# EAGLE board 5409057D (EAGLE 6.6.0), part 1 of 3
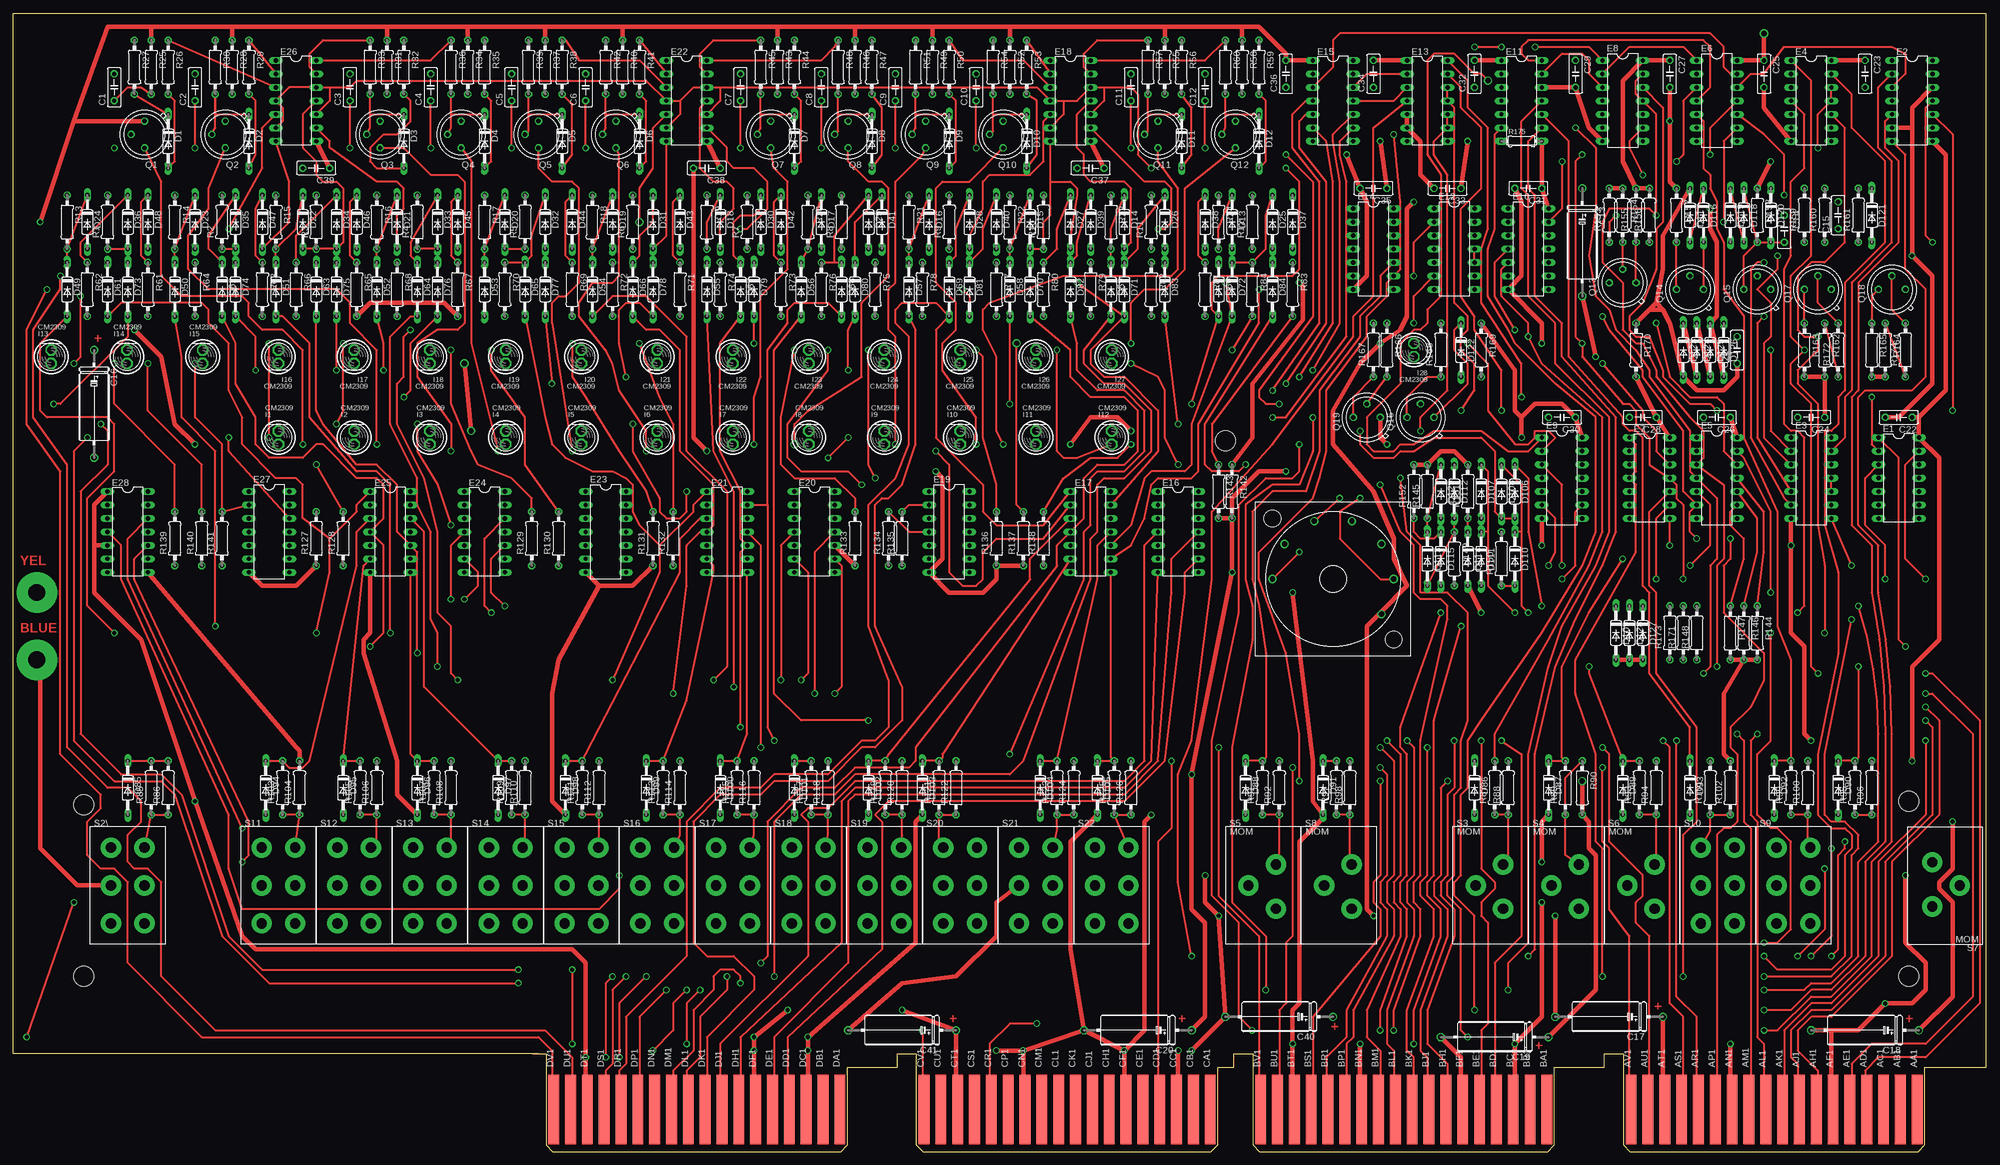
[diagram p3: board, top side]
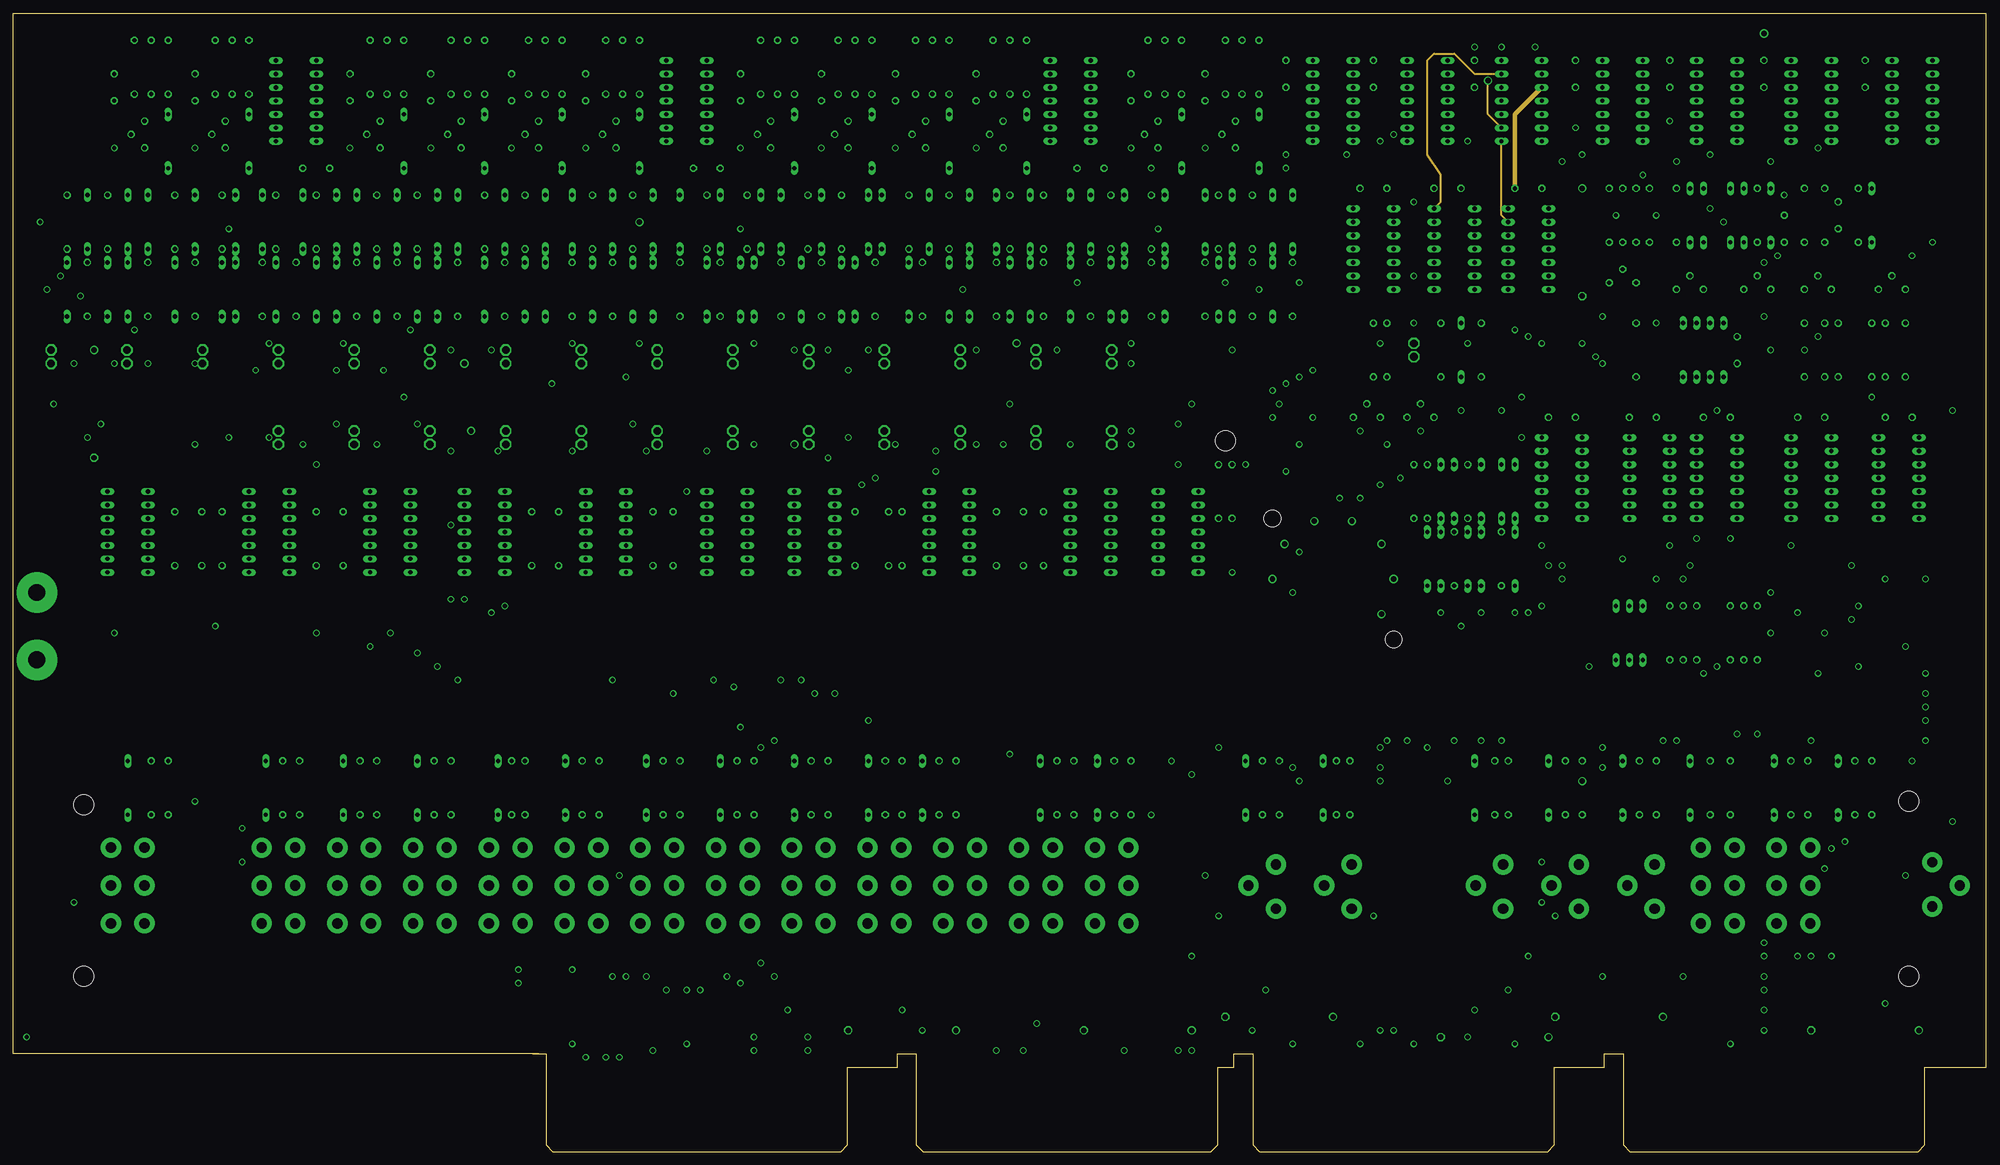
[diagram p4: board, inner layer ECO1]
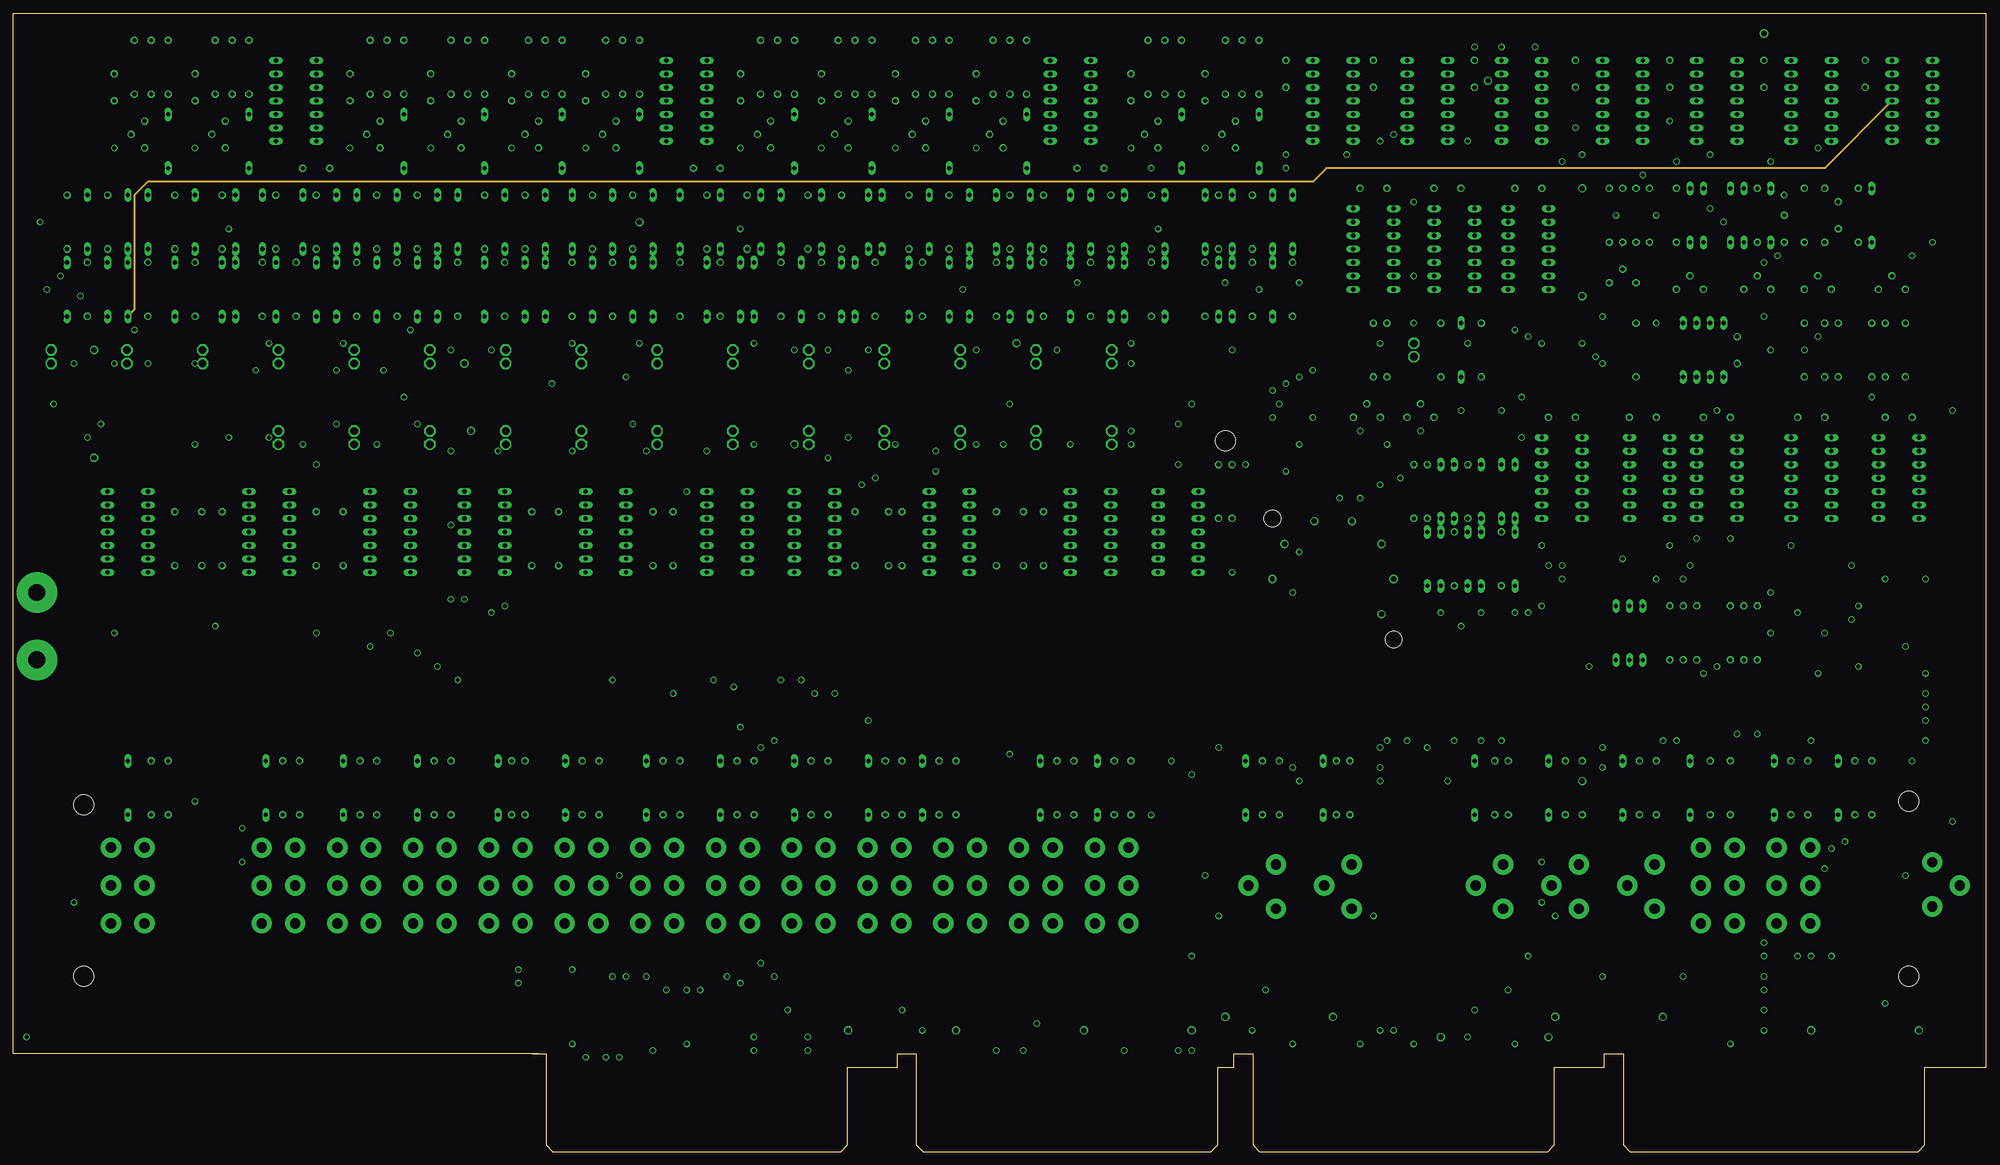
[diagram p5: board, inner layer ECO2]
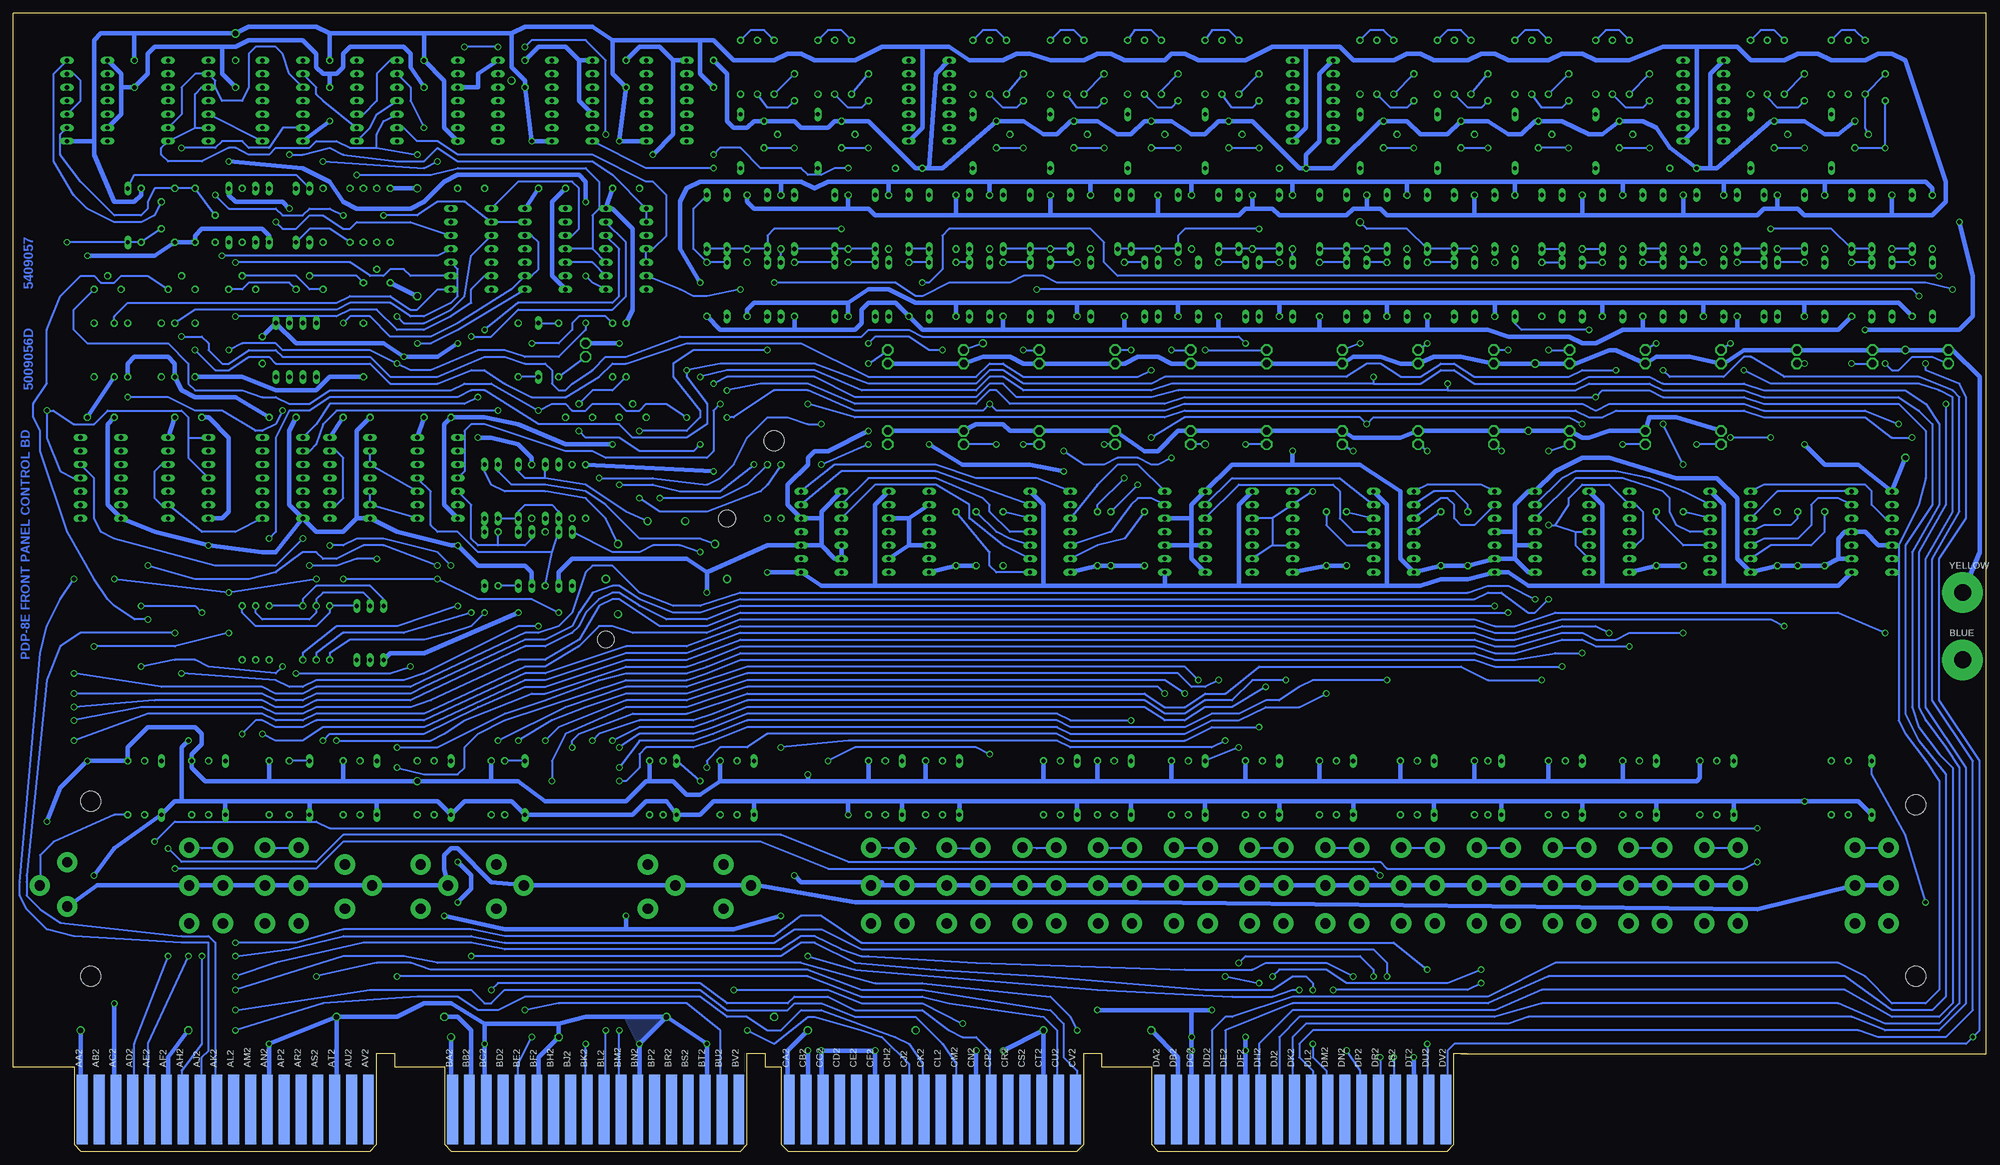
[diagram p6: board, bottom side, seen from below]

Size 372.11 x 214.63 mm. Coordinates in mm from the lower left corner, seen from the top.
Outline: 99.06,18.41 0,18.41 0,214.63 372.11,214.63 372.11,15.88 363.22,15.88
Copper layers (1+2+3+16): Top 0.035mm / dielectric 1.5mm / ECO1 0.035mm / dielectric 0.15mm / ECO2 0.035mm / dielectric 0.2mm / Bottom 0.035mm
Design rules "16mils": minimum track width 16mil, minimum drill 32mil, track to track 15mil, track to pad 10mil, pad to pad 10mil, via to via 10mil, smd to smd 10mil, copper to edge 13mil, drill to drill 10mil, minimum pad ring 10mil, minimum via ring 8mil, stop-mask expansion 0mil, vias tented up to drill 0mil, thermal gap 10mil
Net classes: 1 Supply: width 0.813 mm
Holes 3.81 mm at 13.34,65.41 13.34,33.02 357.5,33.02 357.5,66.04 228.6,133.99

## Footprints (pad centres in the part's own frame; a part is rotated, then mirrored left to right if it is on the bottom)
SPADELUG = drill 3.175 pad 7.62: 1 0,0
C050-025X075 = drill 0.813 octagon: 1 -2.54,0; 2 2.54,0
E12-8 = drill 1.016: + -10.16,0 | drill 1.016 octagon: - 10.16,0
DO35-10 = drill 0.813 long: A 5.08,0; C -5.08,0
DIL14 = drill 0.813 long: 1 -7.62,-3.81; 2 -5.08,-3.81; 3 -2.54,-3.81; 4 0,-3.81; 5 2.54,-3.81; 6 5.08,-3.81; 7 7.62,-3.81; 8 7.62,3.81; 9 5.08,3.81; 10 2.54,3.81; 11 0,3.81; 12 -2.54,3.81; 13 -5.08,3.81; 14 -7.62,3.81
BULB = drill 1.422 octagon: A 0,0; B 0,2.54
TO39 = drill 0.813 octagon: 1 0,-2.54; 2 2.54,0; 3 0,2.54
0207/10 = drill 0.813 octagon: 1 -5.08,0; 2 5.08,0
0204/7 = drill 0.813 octagon: 1 -3.81,0; 2 3.81,0
ROTARY-8E = drill 1.016: 1 -11.43,0; 2 -9.144,6.604; 3 -3.556,10.922; 4 3.556,10.922; 5 9.144,6.604; 6 11.43,0; S 9.144,-6.604 | hole 3.175: -11.43,11.43; 11.43,-11.43
DPDT8I = drill 1.93 pad 3.81: L1 -3.175,7.144; L2 -3.175,0; L3 -3.175,-7.144; R1 3.175,7.144; R2 3.175,0; R3 3.175,-7.144
SPDT8I = drill 1.93 pad 3.81: A1 2.381,3.969; A2 -2.778,0; A3 2.381,-4.366
EDGE-CON8 = smd 2.032 x 13.106: AA1 261.303,7.938; AB1 258.127,7.938; AC1 254.952,7.938; AD1 251.778,7.938; AE1 248.602,7.938; AF1 245.428,7.938; AH1 242.252,7.938; AJ1 239.077,7.938; AK1 235.903,7.938; AL1 232.727,7.938; AM1 229.553,7.938; AN1 226.377,7.938; AP1 223.202,7.938; AR1 220.028,7.938; AS1 216.852,7.938; AT1 213.678,7.938; AU1 210.502,7.938; AV1 207.327,7.938; BA1 191.452,7.938; BB1 188.278,7.938; BC1 185.102,7.938; BD1 181.928,7.938; BE1 178.752,7.938; BF1 175.577,7.938; BH1 172.403,7.938; BJ1 169.227,7.938; BK1 166.053,7.938; BL1 162.877,7.938; BM1 159.702,7.938; BN1 156.528,7.938; BP1 153.352,7.938; BR1 150.178,7.938; BS1 147.002,7.938; BT1 143.827,7.938; BU1 140.653,7.938; BV1 137.477,7.938; CA1 127.953,7.938; CB1 124.778,7.938; CC1 121.603,7.938; CD1 118.427,7.938; CE1 115.252,7.938; CF1 112.078,7.938; CH1 108.903,7.938; CJ1 105.728,7.938; CK1 102.552,7.938; CL1 99.377,7.938; CM1 96.203,7.938; CN1 93.028,7.938; CP1 89.853,7.938; CR1 86.677,7.938; CS1 83.502,7.938; CT1 80.328,7.938; CU1 77.153,7.938; CV1 73.978,7.938; DA1 58.102,7.938; DB1 54.928,7.938; DC1 51.752,7.938; DD1 48.578,7.938; DE1 45.403,7.938; DF1 42.227,7.938; DH1 39.053,7.938; DJ1 35.877,7.938; DK1 32.703,7.938; DL1 29.527,7.938; DM1 26.352,7.938; DN1 23.177,7.938; DP1 20.003,7.938; DR1 16.828,7.938; DS1 13.652,7.938; DT1 10.477,7.938; DU1 7.303,7.938; DV1 4.128,7.938 | smd 2.032 x 13.106 bottom: AA2 261.303,7.938; AB2 258.127,7.938; AC2 254.952,7.938; AD2 251.778,7.938; AE2 248.602,7.938; AF2 245.428,7.938; AH2 242.252,7.938; AJ2 239.077,7.938; AK2 235.903,7.938; AL2 232.727,7.938; AM2 229.553,7.938; AN2 226.377,7.938; AP2 223.202,7.938; AR2 220.028,7.938; AS2 216.852,7.938; AT2 213.678,7.938; AU2 210.502,7.938; AV2 207.327,7.938; BA2 191.452,7.938; BB2 188.278,7.938; BC2 185.102,7.938; BD2 181.928,7.938; BE2 178.752,7.938; BF2 175.577,7.938; BH2 172.403,7.938; BJ2 169.227,7.938; BK2 166.053,7.938; BL2 162.877,7.938; BM2 159.702,7.938; BN2 156.528,7.938; BP2 153.352,7.938; BR2 150.178,7.938; BS2 147.002,7.938; BT2 143.827,7.938; BU2 140.653,7.938; BV2 137.477,7.938; CA2 127.953,7.938; CB2 124.778,7.938; CC2 121.603,7.938; CD2 118.427,7.938; CE2 115.252,7.938; CF2 112.078,7.938; CH2 108.903,7.938; CJ2 105.728,7.938; CK2 102.552,7.938; CL2 99.377,7.938; CM2 96.203,7.938; CN2 93.028,7.938; CP2 89.853,7.938; CR2 86.677,7.938; CS2 83.502,7.938; CT2 80.328,7.938; CU2 77.153,7.938; CV2 73.978,7.938; DA2 58.102,7.938; DB2 54.928,7.938; DC2 51.752,7.938; DD2 48.578,7.938; DE2 45.403,7.938; DF2 42.227,7.938; DH2 39.053,7.938; DJ2 35.877,7.938; DK2 32.703,7.938; DL2 29.527,7.938; DM2 26.352,7.938; DN2 23.177,7.938; DP2 20.003,7.938; DR2 16.828,7.938; DS2 13.652,7.938; DT2 10.477,7.938; DU2 7.303,7.938; DV2 4.128,7.938

## Placement (x,y rotation side)
BLUE  LUG  [SPADELUG]  4.45,92.71 0 bottom
C1  68pF  [C050-025X075]  19.05,200.66 90 top
C2  68pF  [C050-025X075]  34.29,200.66 90 top
C3  68pF  [C050-025X075]  63.5,200.66 90 top
C4  68pF  [C050-025X075]  78.74,200.66 90 top
C5  68pF  [C050-025X075]  93.98,200.66 90 top
C6  68pF  [C050-025X075]  107.95,200.66 90 top
C7  68pF  [C050-025X075]  137.16,200.66 90 top
C8  68pF  [C050-025X075]  152.4,200.66 90 top
C9  68pF  [C050-025X075]  166.37,200.66 90 top
C10  68pF  [C050-025X075]  181.61,200.66 90 top
C11  68pF  [C050-025X075]  210.82,200.66 90 top
C12  68pF  [C050-025X075]  224.79,200.66 90 top
C13  39uF  [E12-8]  295.91,171.45 270 top
C14  56pF  [C050-025X075]  334.01,173.99 270 top
C15  330pF  [C050-025X075]  344.17,176.53 90 top
C16  6.8uF  [E12-8]  15.24,140.97 270 top
C17  6.8uF  [E12-8]  300.99,25.4 180 top
C18  6.8uF  [E12-8]  349.25,22.86 180 top
C19  6.8uF  [E12-8]  279.4,21.59 180 top
C20  6.8uF  [E12-8]  212.09,22.86 180 top
C21  .01uF  [C050-025X075]  325.12,151.13 90 top
C22  .01uF  [C050-025X075]  355.6,138.43 180 top
C23  .01uF  [C050-025X075]  349.25,203.2 270 top
C24  .01uF  [C050-025X075]  339.09,138.43 180 top
C25  .01uF  [C050-025X075]  330.2,203.2 270 top
C26  .01uF  [C050-025X075]  321.31,138.43 180 top
C27  .01uF  [C050-025X075]  312.42,203.2 270 top
C28  .01uF  [C050-025X075]  307.34,138.43 180 top
C29  .01uF  [C050-025X075]  294.64,203.2 270 top
C30  .01uF  [C050-025X075]  292.1,138.43 180 top
C31  .01uF  [C050-025X075]  285.75,181.61 180 top
C32  .01uF  [C050-025X075]  275.59,203.2 90 top
C33  .01uF  [C050-025X075]  270.51,181.61 180 top
C34  .01uF  [C050-025X075]  256.54,203.2 90 top
C35  .01uF  [C050-025X075]  256.54,181.61 180 top
C36  .01uF  [C050-025X075]  240.03,203.2 90 top
C37  .01uF  [C050-025X075]  203.2,185.42 180 top
C38  .01uF  [C050-025X075]  130.81,185.42 180 top
C39  .01uF  [C050-025X075]  57.15,185.42 180 top
C40  6.8uF  [E12-8]  238.76,25.4 180 top
C41  6.8uF  [E12-8]  167.64,22.86 180 top
D1  D664  [DO35-10]  29.21,190.5 270 top
D2  D664  [DO35-10]  44.45,190.5 270 top
D3  D664  [DO35-10]  73.66,190.5 270 top
D4  D664  [DO35-10]  88.9,190.5 270 top
D5  D664  [DO35-10]  103.5,190.5 270 top
D6  D664  [DO35-10]  118.11,190.5 270 top
D7  D664  [DO35-10]  147.32,190.5 270 top
D8  D664  [DO35-10]  161.93,190.5 270 top
D9  D664  [DO35-10]  176.53,190.5 270 top
D10  D664  [DO35-10]  191.13,190.5 270 top
D11  D664  [DO35-10]  220.34,190.5 270 top
D12  D664  [DO35-10]  234.95,190.5 270 top
D13  D664  [DO35-10]  229.87,175.26 270 top
D14  D664  [DO35-10]  209.55,175.26 270 top
D15  D664  [DO35-10]  191.77,175.26 270 top
D16  D664  [DO35-10]  172.72,175.26 270 top
D17  D664  [DO35-10]  152.4,175.26 270 top
D18  D664  [DO35-10]  133.35,175.26 270 top
D19  D664  [DO35-10]  113.03,175.26 270 top
D20  D664  [DO35-10]  92.71,175.26 270 top
D21  D664  [DO35-10]  72.39,175.26 270 top
D22  D664  [DO35-10]  54.61,175.26 270 top
D23  D664  [DO35-10]  34.29,175.26 270 top
D24  D664  [DO35-10]  13.97,175.26 270 top
D25  D664  [DO35-10]  237.49,175.26 270 top
D26  D664  [DO35-10]  217.17,175.26 270 top
D27  D664  [DO35-10]  199.39,175.26 270 top
D28  D664  [DO35-10]  180.34,175.26 270 top
D29  D664  [DO35-10]  161.29,175.26 270 top
D30  D664  [DO35-10]  140.97,175.26 270 top
D31  D664  [DO35-10]  120.65,175.26 270 top
D32  D664  [DO35-10]  100.33,175.26 270 top
D33  D664  [DO35-10]  80.01,175.26 270 top
D34  D664  [DO35-10]  60.96,175.26 270 top
D35  D664  [DO35-10]  41.91,175.26 270 top
D36  D664  [DO35-10]  21.59,175.26 270 top
D37  D664  [DO35-10]  241.3,175.26 270 top
D38  D664  [DO35-10]  224.79,175.26 270 top
D39  D664  [DO35-10]  203.2,175.26 270 top
D40  D664  [DO35-10]  185.42,175.26 270 top
D41  D664  [DO35-10]  163.83,175.26 270 top
D42  D664  [DO35-10]  144.78,175.26 270 top
D43  D664  [DO35-10]  125.73,175.26 270 top
D44  D664  [DO35-10]  105.41,175.26 270 top
D45  D664  [DO35-10]  83.82,175.26 270 top
D46  D664  [DO35-10]  64.77,175.26 270 top
D47  D664  [DO35-10]  46.99,175.26 270 top
D48  D664  [DO35-10]  25.4,175.26 270 top
D49  D664  [DO35-10]  10.16,162.56 270 top
D50  D664  [DO35-10]  30.48,162.56 270 top
D51  D664  [DO35-10]  49.53,162.56 270 top
D52  D664  [DO35-10]  68.58,162.56 270 top
D53  D664  [DO35-10]  88.9,162.56 270 top
D54  D664  [DO35-10]  109.22,162.56 270 top
D55  D664  [DO35-10]  130.81,162.56 270 top
D56  D664  [DO35-10]  148.59,162.56 270 top
D57  D664  [DO35-10]  168.91,162.56 270 top
D58  D664  [DO35-10]  187.96,162.56 270 top
D59  D664  [DO35-10]  207.01,162.56 270 top
D60  D664  [DO35-10]  227.33,162.56 270 top
D61  D664  [DO35-10]  17.78,162.56 270 top
D62  D664  [DO35-10]  39.37,162.56 270 top
D63  D664  [DO35-10]  57.15,162.56 270 top
D64  D664  [DO35-10]  76.2,162.56 270 top
D65  D664  [DO35-10]  96.52,162.56 270 top
D66  D664  [DO35-10]  116.84,162.56 270 top
D67  D664  [DO35-10]  137.16,162.56 270 top
D68  D664  [DO35-10]  156.21,162.56 270 top
D69  D664  [DO35-10]  176.53,162.56 270 top
D70  D664  [DO35-10]  191.77,162.56 270 top
D71  D664  [DO35-10]  209.55,162.56 270 top
D72  D664  [DO35-10]  229.87,162.56 270 top
D73  D664  [DO35-10]  21.59,162.56 270 top
D74  D664  [DO35-10]  41.91,162.56 270 top
D75  D664  [DO35-10]  60.96,162.56 270 top
D76  D664  [DO35-10]  80.01,162.56 270 top
D77  D664  [DO35-10]  100.33,162.56 270 top
D78  D664  [DO35-10]  120.65,162.56 270 top
D79  D664  [DO35-10]  139.7,162.56 270 top
D80  D664  [DO35-10]  158.75,162.56 270 top
D81  D664  [DO35-10]  180.34,162.56 270 top
D82  D664  [DO35-10]  199.39,162.56 270 top
D83  D664  [DO35-10]  217.17,162.56 270 top
D84  D664  [DO35-10]  237.49,162.56 270 top
D85  D664  [DO35-10]  21.59,68.58 270 top
D86  D664  [DO35-10]  275.59,68.58 270 top
D87  D664  [DO35-10]  289.56,68.58 270 top
D88  D664  [DO35-10]  232.41,68.58 270 top
D89  D664  [DO35-10]  303.53,68.58 270 top
D90  D664  [DO35-10]  344.17,68.58 270 top
D91  D664  [DO35-10]  247.01,68.58 270 top
D92  D664  [DO35-10]  332.11,68.58 270 top
D93  D664  [DO35-10]  316.23,68.58 270 top
D94  D664  [DO35-10]  47.62,68.58 270 top
D95  D664  [DO35-10]  62.23,68.58 270 top
D96  D664  [DO35-10]  76.2,68.58 270 top
D97  D664  [DO35-10]  91.44,68.58 270 top
D98  D664  [DO35-10]  104.14,68.58 270 top
D99  D664  [DO35-10]  119.38,68.58 270 top
D100  D664  [DO35-10]  133.35,68.58 270 top
D101  D664  [DO35-10]  147.32,68.58 270 top
D102  D664  [DO35-10]  161.29,68.58 270 top
D103  D664  [DO35-10]  171.45,68.58 270 top
D104  D664  [DO35-10]  193.68,68.58 270 top
D105  D664  [DO35-10]  204.47,68.58 270 top
D106  D662  [DO35-10]  283.21,124.46 270 top
D107  D662  [DO35-10]  276.86,124.46 270 top
D108  D662  [DO35-10]  280.67,124.46 270 top
D109  D664  [DO35-10]  302.26,97.79 270 top
D110  D662  [DO35-10]  283.21,111.76 270 top
D111  D662  [DO35-10]  276.86,111.76 270 top
D112  D662  [DO35-10]  271.78,124.46 270 top
D113  D662  [DO35-10]  266.7,111.76 270 top
D114  D662  [DO35-10]  274.32,111.76 270 top
D115  D662  [DO35-10]  269.24,111.76 270 top
D116  D664  [DO35-10]  318.77,176.53 270 top
D117  D664  [DO35-10]  316.23,176.53 270 top
D118  D664  [DO35-10]  326.39,176.53 270 top
D119  D664  [DO35-10]  323.85,176.53 270 top
D120  D668  [DO35-10]  331.47,176.53 270 top
D121  D664  [DO35-10]  350.52,176.53 270 top
D122  D664  [DO35-10]  273.05,151.13 270 top
D123  D662  [DO35-10]  314.96,151.13 270 top
D124  D662  [DO35-10]  317.5,151.13 270 top
D125  D662  [DO35-10]  320.04,151.13 270 top
D126  D662  [DO35-10]  322.58,151.13 270 top
D127  D664  [DO35-10]  307.34,97.79 270 top
D128  D664  [DO35-10]  304.8,97.79 270 top
D129  D662  [DO35-10]  269.24,124.46 270 top
E1  N8881N  [DIL14]  355.6,127 270 top
E2  SP380N  [DIL14]  358.14,198.12 270 top
E3  7400N  [DIL14]  339.09,127 270 top
E4  N8881N  [DIL14]  339.09,198.12 270 top
E5  7410N  [DIL14]  321.31,127 270 top
E6  7400N  [DIL14]  321.31,198.12 270 top
E7  N8881N  [DIL14]  308.61,127 270 top
E8  7410N  [DIL14]  303.53,198.12 270 top
E9  7404N  [DIL14]  292.1,127 270 top
E10  7404N  [DIL14]  285.75,170.18 270 top
E11  SP384N  [DIL14]  284.48,198.12 270 top
E12  7400N  [DIL14]  271.78,170.18 270 top
E13  SP380N  [DIL14]  266.7,198.12 270 top
E14  7440N  [DIL14]  256.54,170.18 270 top
E15  SP314N  [DIL14]  248.92,198.12 270 top
E16  SP380N  [DIL14]  219.71,116.84 270 top
E17  N8881N  [DIL14]  203.2,116.84 270 top
E18  SP380N  [DIL14]  199.39,198.12 270 top
E19  7416N  [DIL14]  176.53,116.84 270 top
E20  SP380N  [DIL14]  151.13,116.84 270 top
E21  N8881N  [DIL14]  134.62,116.84 270 top
E22  SP380N  [DIL14]  127,198.12 270 top
E23  7416N  [DIL14]  111.76,116.84 270 top
E24  SP380N  [DIL14]  88.9,116.84 270 top
E25  N8881N  [DIL14]  71.12,116.84 270 top
E26  SP380N  [DIL14]  53.34,198.12 270 top
E27  7416N  [DIL14]  48.26,116.84 270 top
E28  SP380N  [DIL14]  21.59,116.84 270 top
I1  CM2309  [BULB]  50.01,133.35 0 top
I2  CM2309  [BULB]  64.29,133.35 0 top
I3  CM2309  [BULB]  78.58,133.35 0 top
I4  CM2309  [BULB]  92.87,133.35 0 top
I5  CM2309  [BULB]  107.16,133.35 0 top
I6  CM2309  [BULB]  121.44,133.35 0 top
I7  CM2309  [BULB]  135.73,133.35 0 top
I8  CM2309  [BULB]  150.02,133.35 0 top
I9  CM2309  [BULB]  164.31,133.35 0 top
I10  CM2309  [BULB]  178.59,133.35 0 top
I11  CM2309  [BULB]  192.88,133.35 0 top
I12  CM2309  [BULB]  207.17,133.35 0 top
I13  CM2309  [BULB]  7.15,148.59 0 top
I14  CM2309  [BULB]  21.43,148.59 0 top
I15  CM2309  [BULB]  35.72,148.59 0 top
I16  CM2309  [BULB]  50.01,151.13 180 top
I17  CM2309  [BULB]  64.29,151.13 180 top
I18  CM2309  [BULB]  78.58,151.13 180 top
I19  CM2309  [BULB]  92.87,151.13 180 top
I20  CM2309  [BULB]  107.16,151.13 180 top
I21  CM2309  [BULB]  121.44,151.13 180 top
I22  CM2309  [BULB]  135.73,151.13 180 top
I23  CM2309  [BULB]  150.02,151.13 180 top
I24  CM2309  [BULB]  164.31,151.13 180 top
I25  CM2309  [BULB]  178.59,151.13 180 top
I26  CM2309  [BULB]  192.88,151.13 180 top
I27  CM2309  [BULB]  207.17,151.13 180 top
I28  CM2309  [BULB]  264.16,152.4 180 top
Q1  2N3009B  [TO39]  24.77,191.77 180 top
Q2  2N3009B  [TO39]  40.01,191.77 180 top
Q3  2N3009B  [TO39]  69.22,191.77 180 top
Q4  2N3009B  [TO39]  84.45,191.77 180 top
Q5  2N3009B  [TO39]  99.06,191.77 180 top
Q6  2N3009B  [TO39]  113.67,191.77 180 top
Q7  2N3009B  [TO39]  142.88,191.77 180 top
Q8  2N3009B  [TO39]  157.48,191.77 180 top
Q9  2N3009B  [TO39]  172.09,191.77 180 top
Q10  2N3009B  [TO39]  186.69,191.77 180 top
Q11  2N3009B  [TO39]  215.9,191.77 180 top
Q12  2N3009B  [TO39]  230.5,191.77 180 top
Q13  MPS6534  [TO39]  303.53,163.83 90 top
Q14  MPS6534  [TO39]  316.23,162.56 90 top
Q15  MPS6534  [TO39]  328.93,162.56 90 top
Q16  MPS6534  [TO39]  265.43,138.43 90 top
Q17  2N3009B  [TO39]  340.36,162.56 90 top
Q18  2N3009B  [TO39]  354.33,162.56 90 top
Q19  2N3009B  [TO39]  255.27,138.43 90 top
R1  15K  [0207/10]  17.78,175.26 90 top
R2  15K  [0207/10]  39.37,175.26 90 top
R3  15K  [0207/10]  57.15,175.26 90 top
R4  15K  [0207/10]  76.2,175.26 90 top
R5  15K  [0207/10]  96.52,175.26 90 top
R6  15K  [0207/10]  116.84,175.26 90 top
R7  15K  [0207/10]  138.43,175.26 90 top
R8  15K  [0207/10]  156.21,175.26 90 top
R9  15K  [0207/10]  176.53,175.26 90 top
R10  15K  [0207/10]  194.31,175.26 90 top
R11  15K  [0207/10]  214.63,175.26 90 top
R12  15K  [0207/10]  233.68,175.26 90 top
R13  33K  [0207/10]  10.16,175.26 270 top
R14  33K  [0207/10]  30.48,175.26 270 top
R15  33K  [0207/10]  49.53,175.26 270 top
R16  33K  [0207/10]  68.58,175.26 270 top
R17  33K  [0207/10]  88.9,175.26 270 top
R18  33K  [0207/10]  109.22,175.26 270 top
R19  33K  [0207/10]  130.81,175.26 270 top
R20  33K  [0207/10]  149.86,175.26 270 top
R21  33K  [0207/10]  168.91,175.26 270 top
R22  33K  [0207/10]  187.96,175.26 270 top
R23  33K  [0207/10]  207.01,175.26 270 top
R24  33K  [0207/10]  227.33,175.26 270 top
R25  390  [0207/10]  26.04,204.47 270 top
R26  33K  [0207/10]  29.21,204.47 270 top
R27  33K  [0207/10]  22.86,204.47 270 top
R28  390  [0207/10]  41.27,204.47 270 top
R29  33K  [0207/10]  44.45,204.47 270 top
R30  33K  [0207/10]  38.1,204.47 270 top
R31  390  [0207/10]  70.48,204.47 270 top
R32  33K  [0207/10]  73.66,204.47 270 top
R33  33K  [0207/10]  67.31,204.47 270 top
R34  390  [0207/10]  85.72,204.47 270 top
R35  33K  [0207/10]  88.9,204.47 270 top
R36  33K  [0207/10]  82.55,204.47 270 top
R37  390  [0207/10]  100.33,204.47 270 top
R38  33K  [0207/10]  103.5,204.47 270 top
R39  33K  [0207/10]  97.16,204.47 270 top
R40  390  [0207/10]  114.94,204.47 270 top
R41  33K  [0207/10]  118.11,204.47 270 top
R42  33K  [0207/10]  111.76,204.47 270 top
R43  390  [0207/10]  144.15,204.47 270 top
R44  33K  [0207/10]  147.32,204.47 270 top
R45  33K  [0207/10]  140.97,204.47 270 top
R46  390  [0207/10]  158.75,204.47 270 top
R47  33K  [0207/10]  161.93,204.47 270 top
R48  33K  [0207/10]  155.57,204.47 270 top
R49  390  [0207/10]  173.35,204.47 270 top
R50  33K  [0207/10]  176.53,204.47 270 top
R51  33K  [0207/10]  170.18,204.47 270 top
R52  390  [0207/10]  187.96,204.47 270 top
R53  33K  [0207/10]  191.13,204.47 270 top
R54  33K  [0207/10]  184.78,204.47 270 top
R55  390  [0207/10]  217.17,204.47 270 top
R56  33K  [0207/10]  220.34,204.47 270 top
R57  33K  [0207/10]  214,204.47 270 top
R58  390  [0207/10]  231.78,204.47 270 top
R59  33K  [0207/10]  234.95,204.47 270 top
R60  33K  [0207/10]  228.6,204.47 270 top
R61  33K  [0207/10]  25.4,162.56 270 top
R62  33K  [0207/10]  13.97,162.56 270 top
R63  33K  [0207/10]  46.99,162.56 270 top
R64  33K  [0207/10]  34.29,162.56 270 top
R65  33K  [0207/10]  64.77,162.56 270 top
R66  33K  [0207/10]  53.34,162.56 270 top
R67  33K  [0207/10]  83.82,162.56 270 top
R68  33K  [0207/10]  72.39,162.56 270 top
R69  33K  [0207/10]  105.41,162.56 270 top
R70  33K  [0207/10]  92.71,162.56 270 top
R71  33K  [0207/10]  125.73,162.56 270 top
R72  33K  [0207/10]  113.03,162.56 270 top
R73  33K  [0207/10]  144.78,162.56 270 top
R74  33K  [0207/10]  133.35,162.56 270 top
R75  33K  [0207/10]  162.56,162.56 270 top
R76  33K  [0207/10]  152.4,162.56 270 top
R77  33K  [0207/10]  185.42,162.56 270 top
R78  33K  [0207/10]  171.45,162.56 270 top
R79  33K  [0207/10]  203.2,162.56 270 top
R80  33K  [0207/10]  194.31,162.56 270 top
R81  33K  [0207/10]  224.79,162.56 270 top
R82  33K  [0207/10]  214.63,162.56 270 top
R83  33K  [0207/10]  241.3,162.56 270 top
R84  33K  [0207/10]  233.68,162.56 270 top
R85  1.5K  [0207/10]  26.04,68.58 90 top
R86  1.5K  [0207/10]  29.21,68.58 90 top
R87  1.5K  [0207/10]  279.4,68.58 90 top
R88  3K  [0207/10]  281.94,68.58 90 top
R89  1.5K  [0207/10]  292.74,68.58 90 top
R90  3K  [0207/10]  295.91,68.58 270 top
R91  1.5K  [0207/10]  235.59,68.58 90 top
R92  3K  [0207/10]  238.76,68.58 90 top
R93  1.5K  [0207/10]  306.7,68.58 90 top
R94  3K  [0207/10]  309.88,68.58 90 top
R95  1.5K  [0207/10]  347.35,68.58 90 top
R96  3K  [0207/10]  350.52,68.58 90 top
R97  1.5K  [0207/10]  249.56,68.58 90 top
R98  3K  [0207/10]  252.09,68.58 90 top
R99  1.5K  [0207/10]  335.28,68.58 90 top
R100  3K  [0207/10]  338.45,68.58 90 top
R101  1.5K  [0207/10]  320.04,68.58 90 top
R102  3K  [0207/10]  323.85,68.58 90 top
R103  1.5K  [0207/10]  50.8,68.58 90 top
R104  3K  [0207/10]  53.98,68.58 90 top
R105  1.5K  [0207/10]  65.41,68.58 90 top
R106  3K  [0207/10]  68.58,68.58 90 top
R107  1.5K  [0207/10]  79.38,68.58 90 top
R108  3K  [0207/10]  82.55,68.58 90 top
R109  1.5K  [0207/10]  93.98,68.58 90 top
R110  3K  [0207/10]  96.52,68.58 90 top
R111  1.5K  [0207/10]  107.31,68.58 90 top
R112  3K  [0207/10]  110.49,68.58 90 top
R113  1.5K  [0207/10]  122.56,68.58 90 top
R114  3K  [0207/10]  125.73,68.58 90 top
R115  1.5K  [0207/10]  136.53,68.58 90 top
R116  3K  [0207/10]  139.7,68.58 90 top
R117  1.5K  [0207/10]  150.5,68.58 90 top
R118  3K  [0207/10]  153.67,68.58 90 top
R119  1.5K  [0207/10]  164.47,68.58 90 top
R120  3K  [0207/10]  167.64,68.58 90 top
R121  1.5K  [0207/10]  174.62,68.58 90 top
R122  3K  [0207/10]  177.8,68.58 90 top
R123  1.5K  [0207/10]  196.85,68.58 90 top
R124  3K  [0207/10]  200.03,68.58 90 top
R125  1.5K  [0207/10]  207.65,68.58 90 top
R126  3K  [0207/10]  210.82,68.58 90 top
R127  390  [0207/10]  57.15,115.57 90 top
R128  390  [0207/10]  62.23,115.57 90 top
R129  390  [0207/10]  97.79,115.57 90 top
R130  390  [0207/10]  102.87,115.57 90 top
R131  390  [0207/10]  120.65,115.57 90 top
R132  390  [0207/10]  124.46,115.57 90 top
R133  390  [0207/10]  158.75,115.57 90 top
R134  390  [0207/10]  165.1,115.57 90 top
R135  390  [0207/10]  167.64,115.57 90 top
R136  390  [0207/10]  185.42,115.57 90 top
R137  390  [0207/10]  190.5,115.57 90 top
R138  390  [0207/10]  194.31,115.57 90 top
R139  390  [0207/10]  30.48,115.57 90 top
R140  390  [0207/10]  35.56,115.57 90 top
R141  390  [0207/10]  39.37,115.57 90 top
R142  3K  [0207/10]  229.87,124.46 270 top
R143  3K  [0207/10]  227.33,124.46 270 top
R144  3K  [0207/10]  328.93,97.79 270 top
R145  3K  [0207/10]  266.7,124.46 90 top
R146  3K  [0207/10]  326.39,97.79 270 top
R147  3K  [0207/10]  323.85,97.79 270 top
R148  4.7K  [0207/10]  317.5,97.79 90 top
R149  1K  [0207/10]  271.78,111.76 270 top
R150  1K  [0207/10]  280.67,111.76 90 top
R151  3K  [0207/10]  274.32,124.46 90 top
R152  3K  [0207/10]  264.16,124.46 90 top
R153  1000  [0207/10]  300.99,176.53 90 top
R154  100  [0207/10]  303.53,176.53 270 top
R155  1000  [0207/10]  306.07,176.53 90 top
R156  150  [0207/10]  308.61,176.53 90 top
R157  3000  [0207/10]  313.69,176.53 270 top
R158  15K  [0207/10]  328.93,176.53 270 top
R159  15K  [0207/10]  337.82,176.53 90 top
R160  15K  [0207/10]  341.63,176.53 90 top
R161  1800  [0207/10]  347.98,176.53 90 top
R162  470  [0207/10]  341.63,151.13 270 top
R163  27  [0207/10]  337.82,151.13 270 top
R164  470  [0207/10]  353.06,151.13 270 top
R165  27  [0207/10]  350.52,151.13 270 top
R166  1K  [0207/10]  259.08,151.13 270 top
R167  470  [0207/10]  256.54,151.13 90 top
R168  1K  [0207/10]  269.24,151.13 90 top
R169  100  [0207/10]  276.86,151.13 270 top
R170  470  [0207/10]  306.07,151.13 270 top
R171  4.7K  [0207/10]  314.96,97.79 90 top
R172  27  [0207/10]  344.17,151.13 90 top
R173  4.7K  [0207/10]  312.42,97.79 90 top
R174  27  [0207/10]  356.87,151.13 90 top
R175  470  [0204/7]  284.48,190.5 0 top
S1  ROTARY8E  [ROTARY-8E]  248.92,107.95 0 top
S2\  DPDT8I  [DPDT8I]  21.59,50.16 0 top
S3  SPDT8I  [SPDT8I]  278.61,50.16 0 top
S4  SPDT8I  [SPDT8I]  292.89,50.16 0 top
S5  SPDT8I  [SPDT8I]  235.74,50.16 0 top
S6  SPDT8I  [SPDT8I]  307.18,50.16 0 top
S7  SPDT8I  [SPDT8I]  364.33,50.16 180 top
S8  SPDT8I  [SPDT8I]  250.03,50.16 0 top
S9  DPDT8I  [DPDT8I]  335.76,50.16 0 top
S10  DPDT8I  [DPDT8I]  321.47,50.16 0 top
S11  DPDT8I  [DPDT8I]  50.01,50.16 0 top
S12  DPDT8I  [DPDT8I]  64.29,50.16 0 top
S13  DPDT8I  [DPDT8I]  78.58,50.16 0 top
S14  DPDT8I  [DPDT8I]  92.87,50.16 0 top
S15  DPDT8I  [DPDT8I]  107.16,50.16 0 top
S16  DPDT8I  [DPDT8I]  121.44,50.16 0 top
S17  DPDT8I  [DPDT8I]  135.73,50.16 0 top
S18  DPDT8I  [DPDT8I]  150.02,50.16 0 top
S19  DPDT8I  [DPDT8I]  164.31,50.16 0 top
S20  DPDT8I  [DPDT8I]  178.59,50.16 0 top
S21  DPDT8I  [DPDT8I]  192.88,50.16 0 top
S22  DPDT8I  [DPDT8I]  207.17,50.16 0 top
U$2  [EDGE-CON8]  97.79,0 0 top
YELLOW  LUG  [SPADELUG]  4.45,105.41 0 bottom

## Tracks (layer width: path | path; a pad name or v marks a point on that pad's centre or on a via)
!RUN  (via drill 0.81 pad 0.81, 1.02 pad 0.81)
  Top 0.406: v275.59,26.67 275.59,44.45 271.78,48.26 271.78,50.8 273.05,52.07 273.05,67.31 274.32,68.58 274.32,77.47 276.86,81.28 288.29,97.79 295.91,110.49 298.45,116.84 298.45,138.43 290.83,144.78 283.21,152.4 281.94,154.94 278.13,161.29 278.13,170.18 279.4,173.99 279.4,191.77 E11.6 | v278.13,201.93 276.86,203.2 275.59,203.2 271.78,207.01 267.97,207.01 266.7,205.74 266.7,187.96 269.24,184.15 269.24,161.29 266.7,158.75 266.7,156.21 265.43,154.94 264.16,154.94 261.62,152.4 261.62,144.78 255.27,138.43 255.27,133.35 256.54,132.08 260.35,132.08 261.62,133.35 264.16,133.35 267.97,135.89 276.86,135.89 281.94,132.08 285.75,132.08 E9.1
  ECO1 0.406: E11.6 278.13,195.58 v278.13,201.93
  Bottom 0.406: U$2.BU2 238.76,8.26 238.76,22.86 245.11,27.94 269.24,27.94 v275.59,26.67
+0.75V  (via drill 0.81 pad 0.81)
  Top 0.813: D126.A D125.C 321.31,157.48 321.31,171.45 320.04,173.99 v320.04,177.8
  Bottom 0.813: v320.04,177.8 321.31,179.07 330.2,179.07 331.47,180.34 D120.C
+3V3
  Top 0.813: 308.61,158.75 R170.1 | 308.61,158.75 311.15,158.75 | 311.15,158.75 312.42,156.21 D123.A 317.5,143.51 322.58,143.51 325.12,146.05 C21.1 | 309.88,160.02 308.61,158.75 | 309.88,160.02 311.15,158.75 | 309.88,160.02 311.15,166.37 311.15,172.72 D117.C
  Bottom 0.406: D117.C 318.77,184.15 349.25,184.15 D121.C
+8V  (via drill 1.02 pad 0.81)
  Top 0.813: v85.09,148.59 v86.36,135.89
  Bottom 0.813: YELLOW.1 1.27,113.03 1.27,146.05 6.35,151.13 I13.B C16.+ I14.B I15.B 45.72,151.13 49.53,148.59 I16.B 55.88,149.86 62.23,149.86 I17.B 69.85,151.13 71.12,151.13 77.47,148.59 I18.B v85.09,148.59 I19.B 99.06,149.86 104.14,149.86 I20.B 110.49,148.59 114.3,149.86 119.38,149.86 I21.B I22.B I23.B 153.67,148.59 156.21,149.86 160.02,149.86 162.56,148.59 I24.B I25.B 181.61,148.59 184.15,149.86 189.23,149.86 I26.B I27.B | I12.B I11.B 190.5,137.16 185.42,137.16 184.15,135.89 I10.B I9.B 158.75,132.08 156.21,132.08 152.4,135.89 I8.B I7.B I6.B 119.38,134.62 110.49,134.62 I5.B I4.B v86.36,135.89 I3.B 76.2,134.62 74.93,134.62 71.12,135.89 I2.B 63.5,138.43 58.42,138.43 I1.B
-15V  (via drill 0.81 pad 0.81)
  Top 0.813: v222.25,19.05 C40.- v227.33,44.45 224.79,46.99 v224.79,52.07 | v290.83,44.45 C17.- | C41.- 167.64,31.75 177.8,33.02 185.42,40.64 185.42,46.99 S21.L2 | v331.47,186.69 R158.1 | v256.54,44.45 255.27,45.72 255.27,99.06 257.81,101.6 | 257.81,101.6 S1.S | v264.16,179.07 262.89,177.8 262.89,157.48 261.62,154.94 v257.81,152.4 254,148.59 248.92,139.7 248.92,133.35 256.54,124.46 260.35,115.57 260.35,111.76 262.89,106.68 257.81,101.6
  Bottom 0.813: S11.L2 S11.R2 S12.L2 S12.R2 S13.L2 S13.R2 S14.L2 S14.R2 S15.L2 S15.R2 S16.L2 S16.R2 S17.L2 S17.R2 S18.L2 S18.R2 S19.L2 S19.R2 S20.L2 S20.R2 S21.L2 S21.R2 S22.L2 S22.R2 208.28,50.8 223.52,50.8 v224.79,52.07 | U$2.DB2 152.4,8.26 152.4,17.78 C41.- | U$2.CB2 222.25,8.26 v222.25,19.05 | v257.81,152.4 I28.A | U$2.BB2 285.75,8.26 285.75,22.86 288.29,25.4 C17.- | v227.33,44.45 236.22,41.91 256.54,41.91 | 256.54,41.91 v256.54,44.45 | 256.54,41.91 279.4,41.91 v290.83,44.45 | v264.16,179.07 264.16,182.88 265.43,184.15 288.29,184.15 290.83,182.88 294.64,179.07 297.18,177.8 307.34,177.8 309.88,179.07 312.42,182.88 317.5,185.42 v331.47,186.69
AC_EN  (via drill 0.81 pad 0.81)
  Top 0.406: D107.C 278.13,128.27 278.13,116.84 | 278.13,116.84 D111.C | v283.21,101.6 278.13,106.68 278.13,116.84
  Bottom 0.406: S1.4 256.54,120.65 264.16,125.73 271.78,127 | 271.78,127 D112.C | D107.C 276.86,128.27 275.59,127 271.78,127 | R173.1 312.42,93.98 308.61,96.52 294.64,96.52 289.56,97.79 285.75,99.06 v283.21,101.6
BK_DATA_CONT  (via drill 0.81 pad 0.81)
  Top 0.406: v264.16,20.32 264.16,26.67 269.24,40.64 269.24,45.72 266.7,48.26 266.7,50.8 267.97,52.07 267.97,81.28 v273.05,99.06 | E4.1 339.09,201.93 339.09,168.91 335.28,165.1 335.28,153.67 v337.82,151.13 335.28,148.59 335.28,144.78 339.09,140.97 339.09,91.44 v340.36,90.17 | v157.48,147.32 157.48,154.94 D80.A
  Bottom 0.406: U$2.BK2 264.16,8.26 v264.16,20.32 | v157.48,147.32 160.02,146.05 181.61,146.05 185.42,148.59 187.96,148.59 190.5,146.05 210.82,146.05 223.52,152.4 245.11,152.4 256.54,148.59 259.08,148.59 261.62,146.05 267.97,142.24 274.32,142.24 279.4,144.78 283.21,147.32 285.75,147.32 292.1,144.78 300.99,144.78 304.8,148.59 322.58,148.59 323.85,149.86 327.66,149.86 331.47,147.32 334.01,147.32 v337.82,151.13 | v273.05,99.06 276.86,99.06 294.64,90.17 298.45,88.9 314.96,88.9 317.5,87.63 320.04,87.63 322.58,88.9 v340.36,90.17
BREAK_C  (via drill 0.81 pad 0.81)
  Top 0.406: v260.35,22.86 260.35,26.67 265.43,40.64 265.43,45.72 264.16,46.99 264.16,50.8 265.43,52.07 265.43,77.47 270.51,100.33 270.51,102.87 269.24,104.14 265.43,104.14 264.16,105.41 264.16,114.3 261.62,116.84 v257.81,125.73 | D84.A 224.79,137.16 224.79,129.54 226.06,128.27 231.14,128.27 v232.41,129.54
  Bottom 0.406: U$2.BL2 260.35,8.26 v260.35,22.86 | v232.41,129.54 238.76,124.46 246.38,124.46 251.46,125.73 v257.81,125.73
BRK_INP  (via drill 0.81 pad 0.81)
  Top 0.406: v274.32,21.59 273.05,22.86 273.05,45.72 270.51,48.26 270.51,50.8 271.78,52.07 271.78,67.31 273.05,68.58 273.05,77.47 274.32,81.28 274.32,101.6 270.51,105.41 265.43,105.41 265.43,114.3 262.89,116.84 v261.62,127 | v219.71,137.16 D83.A
  Bottom 0.406: U$2.BE2 276.86,8.26 276.86,16.51 v274.32,21.59 | v219.71,137.16 222.25,137.16 226.06,138.43 229.87,138.43 233.68,134.62 236.22,129.54 238.76,127 241.3,125.73 251.46,127 v261.62,127
BUS_EN  (via drill 0.81 pad 0.81)
  Top 0.406: S1.1 v242.57,113.03 | D113.C R145.1 D129.C
  Bottom 0.406: v242.57,113.03 246.38,114.3 251.46,114.3 254,113.03 259.08,113.03 D113.C
CLR  (via drill 0.81 pad 0.81)
  Top 0.406: R87.2 279.4,78.74 289.56,96.52 297.18,110.49 299.72,116.84 299.72,138.43 288.29,148.59 v285.75,153.67 285.75,156.21 280.67,161.29 280.67,166.37 E10.5
  Bottom 0.406: D86.C R87.2 | E14.13 256.54,171.45 256.54,161.29 259.08,158.75 276.86,158.75 281.94,153.67 v285.75,153.67
CONT  (via drill 0.81 pad 0.81)
  Top 0.406: D87.C R89.2 292.1,74.3 292.1,91.44 297.18,101.6 v303.53,111.76 | v316.23,110.49 320.04,114.3 320.04,121.92 E5.5
  Bottom 0.406: v303.53,111.76 307.34,111.76 311.15,110.49 v316.23,110.49
CP_START  (via drill 0.81 pad 0.81)
  Top 0.406: E1.3 349.25,127 349.25,118.11 353.06,114.3 v353.06,107.95 | E5.13 326.39,130.81 331.47,120.65 v331.47,105.41 | v295.91,187.96 294.64,186.69 294.64,153.67 v295.91,152.4 295.91,149.86 303.53,140.97 304.8,140.97 306.07,139.7 306.07,137.16 308.61,134.62 308.61,129.54 E7.11 313.69,125.73 313.69,123.19 314.96,121.92 v314.96,107.95
  Bottom 0.406: E8.5 302.26,194.31 303.53,191.77 303.53,189.23 | 303.53,189.23 v295.91,187.96 | 303.53,189.23 308.61,189.23 311.15,190.5 314.96,190.5 316.23,189.23 322.58,189.23 323.85,187.96 327.66,187.96 330.2,189.23 331.47,189.23 336.55,186.69 342.9,186.69 344.17,187.96 344.17,189.23 E4.8 337.82,193.04 | E4.3 336.55,200.66 337.82,199.39 337.82,193.04 | 337.82,193.04 E4.6 | E12.8 288.29,154.94 293.37,152.4 v295.91,152.4 | v314.96,107.95 v331.47,105.41 v353.06,107.95
D  (via drill 0.81 pad 0.81)
  Top 0.406: D74.A 45.72,153.67 v45.72,147.32
  Bottom 0.406: U$2.DK2 130.81,8.26 130.81,21.59 128.27,24.13 90.17,24.13 86.36,25.4 25.4,25.4 19.05,22.86 8.89,22.86 3.81,27.94 3.81,72.39 11.43,83.82 11.43,111.76 6.35,120.65 6.35,142.24 8.89,143.51 12.7,144.78 40.64,144.78 v45.72,147.32
DATA00  (via drill 0.81 pad 0.81)
  Top 0.406: U$2.AR1 317.5,8.26 317.5,25.4 313.69,29.21 v313.69,77.47 | v57.15,97.79 59.69,109.22 59.69,115.57 | 59.69,115.57 54.61,119.38 54.61,125.73 53.34,127 49.53,127 43.18,133.35 43.18,138.43 40.64,143.51 40.64,152.4 36.83,156.21 36.83,158.75 35.56,160.02 20.32,160.02 D61.A | 59.69,115.57 64.77,120.65 64.77,121.92 E25.1
  Bottom 0.406: v57.15,97.79 67.31,97.79 69.85,96.52 73.66,96.52 76.2,97.79 80.01,97.79 88.9,95.25 92.71,95.25 96.52,96.52 234.95,96.52 245.11,92.71 256.54,92.71 271.78,87.63 275.59,87.63 284.48,83.82 294.64,78.74 312.42,78.74 v313.69,77.47
DATA01  (via drill 0.81 pad 0.81)
  Top 0.406: U$2.AS1 314.96,8.26 314.96,25.4 312.42,27.94 312.42,76.2 v311.15,77.47 | v67.31,95.25 69.85,97.79 69.85,114.3 E25.4 69.85,119.38 69.85,125.73 68.58,127 64.77,127 58.42,133.35 57.15,133.35 54.61,130.81 48.26,130.81 45.72,133.35 45.72,138.43 41.91,144.78 41.91,152.4 D62.A
  Bottom 0.406: v67.31,95.25 73.66,95.25 76.2,96.52 80.01,96.52 88.9,93.98 92.71,93.98 96.52,95.25 234.95,95.25 241.3,92.71 245.11,91.44 256.54,91.44 271.78,86.36 274.32,86.36 287.02,81.28 290.83,78.74 293.37,77.47 v311.15,77.47
DATA02  (via drill 0.81 pad 0.81)
  Top 0.406: v76.2,93.98 76.2,113.03 E25.10 72.39,116.84 72.39,125.73 68.58,129.54 64.77,129.54 58.42,137.16 57.15,139.7 D63.A | U$2.AU1 308.61,8.26 308.61,40.64 306.07,43.18 306.07,46.99 307.34,48.26 307.34,52.07 300.99,58.42 300.99,74.93 v299.72,76.2
  Bottom 0.406: v76.2,93.98 81.28,93.98 88.9,92.71 92.71,92.71 96.52,93.98 234.95,93.98 241.3,91.44 245.11,90.17 256.54,90.17 261.62,88.9 271.78,85.09 279.4,82.55 292.1,76.2 v299.72,76.2
DATA03  (via drill 0.81 pad 0.81)
  Top 0.406: U$2.AV1 304.8,8.26 304.8,40.64 300.99,45.72 300.99,57.15 299.72,58.42 v299.72,72.39 | v80.01,91.44 80.01,97.79 78.74,100.33 78.74,116.84 76.2,121.92 | 76.2,121.92 E25.13 | 76.2,121.92 76.2,127 71.12,137.16 71.12,153.67 74.93,157.48 D64.A
  Bottom 0.406: v80.01,91.44 92.71,91.44 96.52,92.71 234.95,92.71 241.3,90.17 245.11,88.9 256.54,88.9 279.4,81.28 284.48,78.74 287.02,76.2 287.02,72.39 288.29,71.12 294.64,71.12 v299.72,72.39
DATA04  (via drill 0.81 pad 0.81)
  Top 0.406: U$2.BR1 247.65,8.26 247.65,17.78 251.46,21.59 251.46,26.67 259.08,40.64 259.08,45.72 257.81,46.99 257.81,50.8 259.08,52.07 259.08,71.12 v257.81,72.39 | v113.03,88.9 121.92,109.22 121.92,114.3 | 121.92,114.3 128.27,120.65 128.27,121.92 E21.1 | 121.92,114.3 118.11,118.11 116.84,120.65 116.84,125.73 115.57,127 113.03,128.27 109.22,128.27 104.14,130.81 101.6,133.35 100.33,138.43 D65.A
  Bottom 0.406: v113.03,88.9 127,88.9 129.54,87.63 133.35,85.09 135.89,85.09 140.97,82.55 146.05,82.55 151.13,80.01 172.72,80.01 175.26,81.28 233.68,81.28 240.03,78.74 243.84,77.47 254,77.47 v257.81,72.39
DATA05  (via drill 0.81 pad 0.81)
  Top 0.406: U$2.BS1 245.11,8.26 245.11,25.4 257.81,40.64 257.81,45.72 256.54,46.99 256.54,50.8 257.81,52.07 v257.81,69.85 | v124.46,86.36 127,106.68 127,114.3 129.54,116.84 E21.4 132.08,118.11 132.08,125.73 125.73,132.08 125.73,151.13 121.92,154.94 119.38,154.94 D66.A
  Bottom 0.406: v124.46,86.36 129.54,83.82 135.89,83.82 140.97,81.28 146.05,81.28 151.13,78.74 172.72,78.74 175.26,80.01 233.68,80.01 240.03,77.47 243.84,76.2 252.73,76.2 254,74.93 254,72.39 256.54,69.85 v257.81,69.85
DATA06  (via drill 0.81 pad 0.81)
  Top 0.406: U$2.BU1 238.76,8.26 238.76,26.67 240.03,27.94 240.03,39.37 241.3,40.64 v241.3,72.39 | v137.16,80.01 137.16,113.03 E21.10 137.16,115.57 137.16,124.46 133.35,132.08 133.35,152.4 D67.A
  Bottom 0.406: v137.16,80.01 146.05,80.01 151.13,77.47 172.72,77.47 175.26,78.74 229.87,78.74 233.68,76.2 238.76,76.2 241.3,73.66 v241.3,72.39
DATA07  (via drill 0.81 pad 0.81)
  Top 0.406: U$2.BV1 234.95,8.26 234.95,40.64 227.33,48.26 v227.33,76.2 | v143.51,77.47 142.24,80.01 142.24,121.92 | E21.13 142.24,121.92 | D68.A 153.67,160.02 147.32,160.02 146.05,158.75 146.05,156.21 142.24,151.13 142.24,121.92
  Bottom 0.406: v143.51,77.47 146.05,76.2 172.72,76.2 175.26,77.47 214.63,77.47 v227.33,76.2
DATA08
  Top 0.406: U$2.DR1 114.3,8.26 114.3,15.24 115.57,16.51 115.57,25.4 127,36.83 127,62.23 133.35,68.58 140.97,68.58 143.51,71.12 153.67,71.12 160.02,77.47 162.56,77.47 165.1,80.01 165.1,88.9 161.29,99.06 161.29,121.92 166.37,127 168.91,133.35 168.91,153.67 166.37,156.21 166.37,158.75 167.64,160.02 173.99,160.02 D69.A 173.99,154.94 173.99,134.62 182.88,125.73 182.88,120.65 185.42,118.11 194.31,118.11 E17.1
DATA09  (via drill 0.81 pad 0.81)
  Top 0.406: U$2.DS1 111.76,8.26 111.76,15.24 113.03,16.51 113.03,30.48 v115.57,33.02 | v140.97,35.56 142.24,36.83 142.24,62.23 148.59,68.58 154.94,68.58 158.75,72.39 168.91,72.39 170.18,73.66 170.18,76.2 196.85,110.49 196.85,114.3 E17.4 201.93,119.38 201.93,127 204.47,129.54 209.55,129.54 212.09,132.08 212.09,139.7 209.55,142.24 203.2,142.24 199.39,146.05 199.39,151.13 D70.A
  Bottom 0.406: v115.57,33.02 115.57,34.29 118.11,36.83 139.7,36.83 v140.97,35.56
DATA10  (via drill 0.81 pad 0.81)
  Top 0.406: U$2.DU1 105.41,8.26 105.41,17.78 100.33,22.86 38.1,22.86 27.94,33.02 27.94,50.8 25.4,53.34 22.86,53.34 21.59,54.61 21.59,59.69 24.13,62.23 24.13,66.04 21.59,68.58 17.78,68.58 10.16,76.2 10.16,129.54 3.81,138.43 3.81,154.94 8.89,162.56 v8.89,165.1 | E17.13 215.9,132.08 215.9,139.7 209.55,146.05 205.74,146.05 203.2,148.59 203.2,151.13 D71.A v200.66,163.83
  Bottom 0.406: v8.89,165.1 163.83,165.1 166.37,167.64 166.37,171.45 168.91,173.99 195.58,173.99 196.85,172.72 196.85,166.37 199.39,163.83 v200.66,163.83
DATA11  (via drill 0.81 pad 0.81)
  Top 0.406: U$2.DV1 101.6,8.26 101.6,19.05 99.06,21.59 35.56,21.59 21.59,35.56 21.59,50.8 19.05,53.34 16.51,53.34 13.97,55.88 13.97,62.23 16.51,64.77 16.51,67.31 8.89,74.93 8.89,128.27 2.54,137.16 2.54,154.94 v6.35,162.56 | E17.10 210.82,118.11 213.36,127 214.63,128.27 220.98,128.27 222.25,129.54 222.25,137.16 D72.A v228.6,163.83
  Bottom 0.406: v6.35,162.56 11.43,163.83 175.26,163.83 177.8,165.1 181.61,165.1 184.15,163.83 195.58,163.83 200.66,161.29 201.93,161.29 205.74,163.83 v228.6,163.83
DATA_EN  (via drill 0.81 pad 0.81)
  Top 0.406: R84.2 v229.87,151.13 | v254,135.89 254,133.35 256.54,130.81 260.35,130.81 261.62,132.08 264.16,132.08 267.97,134.62 276.86,134.62 279.4,132.08 279.4,120.65 D108.A D106.A
  Bottom 0.406: D129.A 269.24,120.65 270.51,121.92 275.59,121.92 276.86,120.65 D107.A D108.A | v229.87,151.13 243.84,151.13 247.65,148.59 247.65,146.05 242.57,139.7 242.57,138.43 245.11,135.89 v254,135.89
  Bottom 0.813: R62.2 16.51,160.02 34.29,160.02 | 34.29,160.02 R64.2 | 53.34,160.02 R66.2 | 53.34,160.02 34.29,160.02 | 72.39,160.02 R68.2 | 72.39,160.02 53.34,160.02 | R72.2 113.03,160.02 | 113.03,160.02 92.71,160.02 | 92.71,160.02 72.39,160.02 | 92.71,160.02 R70.2 | 133.35,160.02 R74.2 | 113.03,160.02 133.35,160.02 | 152.4,160.02 R76.2 | 133.35,160.02 152.4,160.02 | 171.45,160.02 R78.2 | 152.4,160.02 171.45,160.02 | 194.31,160.02 R80.2 | 171.45,160.02 194.31,160.02 | 214.63,160.02 R82.2 | 214.63,160.02 210.82,162.56 207.01,162.56 201.93,160.02 194.31,160.02 | R84.2 233.68,158.75 232.41,160.02 214.63,160.02
DEP  (via drill 0.81 pad 0.81)
  Top 0.406: D90.C R95.2 347.98,74.3 v347.98,91.44 | v321.31,91.44 321.31,110.49 322.58,111.76 322.58,125.73 E5.3 318.77,130.81 318.77,135.89 316.23,138.43 309.88,146.05 309.88,147.32 307.34,152.4 306.07,152.4 303.53,154.94 303.53,163.83 299.72,167.64 299.72,175.26 300.99,177.8 308.61,177.8 v309.88,176.53 309.88,195.58 E8.11 306.07,199.39 306.07,201.93 E8.13 | E6.10 330.2,191.77 334.01,187.96 v334.01,180.34
  Bottom 0.406: v321.31,91.44 322.58,90.17 335.28,91.44 337.82,92.71 341.63,92.71 v347.98,91.44 | v309.88,176.53 312.42,177.8 316.23,177.8 317.5,176.53 321.31,176.53 322.58,177.8 331.47,177.8 v334.01,180.34
DEP+EXAM+CONT  (via drill 0.81 pad 0.81)
  Top 0.406: v317.5,115.57 316.23,116.84 316.23,120.65 E5.6 314.96,124.46 314.96,135.89 307.34,146.05 307.34,147.32 300.99,154.94 v299.72,157.48
  Bottom 0.406: E10.3 285.75,168.91 287.02,161.29 289.56,158.75 294.64,156.21 298.45,156.21 v299.72,157.48 | v317.5,115.57 322.58,110.49 334.01,110.49 353.06,115.57 355.6,116.84 356.87,119.38 356.87,127 E1.12
E  (via drill 0.81 pad 0.81)
  Top 0.406: v60.96,147.32 D75.A
  Bottom 0.406: U$2.DL2 127,8.26 127,15.24 129.54,17.78 129.54,20.32 127,22.86 24.13,22.86 20.32,21.59 7.62,21.59 2.54,26.67 2.54,73.66 10.16,85.09 10.16,111.76 5.08,120.65 5.08,142.24 6.35,143.51 12.7,146.05 38.1,146.05 44.45,149.86 45.72,149.86 49.53,146.05 59.69,146.05 v60.96,147.32
EMA0  (via drill 0.81 pad 0.81)
  Top 0.406: E28.12 21.59,115.57 21.59,107.95 v43.18,60.96 | v342.9,36.83 344.17,38.1 344.17,55.88 345.44,57.15 v345.44,58.42
  Bottom 0.406: U$2.AD2 349.25,8.26 349.25,20.32 v342.9,36.83 | v43.18,60.96 312.42,60.96 314.96,62.23 341.63,62.23 v345.44,58.42
EMA1  (via drill 0.81 pad 0.81)
  Top 0.406: E28.10 22.86,111.76 22.86,107.95 44.45,62.23 44.45,55.88 v43.18,54.61 | v339.09,36.83 342.9,40.64 v342.9,57.15
  Bottom 0.406: U$2.AE2 346.71,8.26 346.71,20.32 v339.09,36.83 | v43.18,54.61 45.72,53.34 113.03,53.34 114.3,54.61 214.63,54.61 227.33,59.69 309.88,59.69 314.96,54.61 340.36,54.61 v342.9,57.15
EMA2  (via drill 0.81 pad 0.81)
  Top 0.406: E28.4 20.32,114.3 20.32,107.95 40.64,63.5 40.64,53.34 43.18,45.72 110.49,45.72 114.3,49.53 v114.3,52.07 | v336.55,36.83 341.63,41.91 v341.63,53.34
  Bottom 0.406: U$2.AH2 340.36,8.26 340.36,15.24 336.55,20.32 v336.55,36.83 | v114.3,52.07 115.57,53.34 218.44,53.34 231.14,58.42 309.88,58.42 314.96,53.34 v341.63,53.34
EXAM  (via drill 0.81 pad 0.81)
  Top 0.406: R93.2 D89.C 297.18,90.17 v297.18,91.44 | v318.77,90.17 320.04,91.44 320.04,110.49 321.31,111.76 321.31,123.19 E5.4 316.23,128.27 316.23,135.89 308.61,146.05 308.61,147.32 306.07,151.13 302.26,154.94 300.99,158.75 298.45,161.29 297.18,168.91 298.45,177.8 298.45,189.23 v294.64,193.04 | E6.1 314.96,208.28 304.8,208.28 E8.2
  Bottom 0.406: E8.2 297.18,200.66 297.18,198.12 v294.64,193.04 | v297.18,91.44 300.99,90.17 v318.77,90.17
EXT_LOAD  (via drill 0.81 pad 0.81)
  Top 0.406: D91.C R97.2 | v242.57,69.85 242.57,78.74 240.03,93.98 234.95,107.95 234.95,113.03 245.11,123.19 246.38,127 247.65,132.08 247.65,143.51 255.27,153.67 255.27,157.48 259.08,161.29 259.08,163.83 E14.9 261.62,166.37 261.62,179.07 v260.35,191.77 | v275.59,208.28 v280.67,208.28 | v287.02,208.28 297.18,208.28 E8.1
  Bottom 0.406: E14.9 262.89,167.64 E12.5 | E8.1 300.99,205.74 303.53,203.2 303.53,198.12 306.07,195.58 E8.10 | v242.57,69.85 D91.C | v275.59,208.28 274.32,209.55 264.16,209.55 260.35,205.74 v260.35,191.77 | v280.67,208.28 v287.02,208.28
FETCH  (via drill 0.81 pad 0.81)
  Top 0.406: v7.62,140.97 8.89,140.97 21.59,153.67 D73.A
  ECO2 0.406: E2.4 341.63,185.42 247.65,185.42 245.11,182.88 25.4,182.88 22.86,180.34 22.86,158.75 D73.A
  Bottom 0.406: U$2.DJ2 133.35,8.26 133.35,21.59 129.54,25.4 92.71,25.4 83.82,27.94 27.94,27.94 19.05,24.13 8.89,24.13 5.08,27.94 5.08,72.39 7.62,76.2 11.43,81.28 12.7,83.82 12.7,113.03 7.62,121.92 v7.62,140.97
FSET  (via drill 0.81 pad 0.81)
  Top 0.406: v120.65,19.05 124.46,22.86 124.46,27.94 v127,30.48 | v285.75,36.83 287.02,38.1 287.02,74.93 290.83,91.44 294.64,100.33 299.72,110.49 302.26,116.84 302.26,138.43 292.1,149.86 292.1,156.21 287.02,161.29 287.02,180.34 285.75,181.61 285.75,190.5 E11.9
  Bottom 0.406: U$2.DP2 118.11,8.26 118.11,15.24 v120.65,19.05 | v127,30.48 127,31.75 128.27,33.02 130.81,33.02 134.62,30.48 147.32,30.48 177.8,33.02 198.12,34.29 213.36,35.56 220.98,39.37 223.52,39.37 227.33,36.83 v285.75,36.83
GND  (via drill 0.81 pad 0.81)
  Top 0.813: R137.1 R136.1 185.42,107.95 182.88,105.41 176.53,105.41 E19.7 175.26,111.76 175.26,127 v173.99,128.27 | 11.43,194.31 v5.08,175.26 | 11.43,194.31 Q1.1 | 11.43,194.31 17.78,212.09 26.04,212.09 | R133.1 E20.10 | v22.86,154.94 27.94,149.86 30.48,137.16 v34.29,133.35 | 41.27,212.09 R28.1 | 26.04,212.09 R25.1 | 41.27,212.09 26.04,212.09 | E27.7 46.99,106.68 53.34,106.68 R127.1 | 70.48,212.09 41.27,212.09 | 70.48,212.09 R31.1 | 85.72,212.09 70.48,212.09 | 85.72,212.09 R34.1 | C38.2 128.27,134.62 v130.81,132.08 | U$2.DT1 107.95,8.26 v107.95,17.78 107.95,35.56 105.41,38.1 45.72,38.1 43.18,40.64 v34.29,66.04 24.13,96.52 15.24,105.41 15.24,114.3 | 100.33,212.09 85.72,212.09 | 100.33,212.09 R37.1 | 114.94,212.09 100.33,212.09 | 114.94,212.09 R40.1 | E28.1 15.24,121.92 15.24,114.3 | 144.15,212.09 114.94,212.09 | 144.15,212.09 R43.1 | 158.75,212.09 144.15,212.09 | 158.75,212.09 R46.1 | E25.7 67.31,97.79 66.04,96.52 66.04,93.98 72.39,73.66 72.39,67.31 D96.A | 15.24,114.3 E28.5 | 173.35,212.09 158.75,212.09 | 173.35,212.09 R49.1 | 187.96,212.09 173.35,212.09 | 187.96,212.09 R52.1 | R131.1 116.84,106.68 110.49,106.68 | 110.49,106.68 E23.7 | 217.17,212.09 187.96,212.09 | 217.17,212.09 R55.1 | 231.78,212.09 R58.1 | 231.78,212.09 217.17,212.09 | 110.49,106.68 102.87,92.71 101.6,86.36 101.6,66.04 D98.A | U$2.DF1 139.7,8.26 v139.7,19.05 v139.7,21.59 v146.05,26.67 | 231.78,212.09 234.95,212.09 240.03,207.01 C36.2 E15.1 | U$2.CT1 177.8,8.26 C41.+ v167.64,26.67 | U$2.DC1 149.86,8.26 v149.86,19.05 v149.86,21.59 170.18,39.37 170.18,62.23 D103.A | v251.46,187.96 C35.2 255.27,179.07 255.27,165.1 E14.7 | U$2.CN1 190.5,8.26 v190.5,19.05
  Top 0.813: C33.2 265.43,184.15 265.43,190.5 E13.6 E13.5 | U$2.CC1 219.71,8.26 v219.71,19.05 | v190.5,19.05 v185.42,19.05 | U$2.CF1 209.55,8.26 v209.55,19.05 | C20.- v190.5,19.05 | C20.- 199.39,38.1 199.39,58.42 D105.A | v209.55,19.05 C20.- | v209.55,19.05 213.36,22.86 213.36,62.23 v214.63,63.5 | U$2.AN1 323.85,8.26 v323.85,20.32 | E13.1 C34.2 | U$2.AT1 311.15,8.26 C17.+ | U$2.BT1 241.3,8.26 v241.3,20.32 241.3,26.67 242.57,27.94 242.57,58.42 247.01,62.87 D91.A 245.11,66.04 245.11,73.66 v241.3,105.41 | U$2.BN1 254,8.26 v254,20.32 | U$2.BF2 273.05,8.26 273.05,17.78 C19.- | E11.1 C32.2 | U$2.BC1 283.21,8.26 v283.21,20.32 288.29,25.4 v288.29,46.99 | D127.A D128.A D109.A | U$2.AF1 342.9,8.26 342.9,22.86 | 342.9,22.86 C18.- | E8.7 297.18,193.04 C29.2 E11.12 | 342.9,22.86 347.98,22.86 v353.06,27.94 358.14,27.94 360.68,30.48 360.68,35.56 356.87,39.37 v356.87,52.07 | D114.A v276.86,101.6 | R157.1 312.42,182.88 v312.42,194.31 C27.2 | v288.29,54.61 288.29,62.23 D87.A | v288.29,114.3 E9.7 | v339.09,77.47 337.82,78.74 337.82,95.25 335.28,97.79 v335.28,114.3 E3.7 | C22.2 355.6,138.43 361.95,144.78 361.95,165.1 v358.14,168.91 358.14,193.04 | E2.12 358.14,196.85 358.14,193.04 | E4.7 330.2,196.85 C25.2 | v210.82,135.89 208.28,138.43 203.2,138.43 v199.39,133.35 | v288.29,152.4 288.29,156.21 E10.7 284.48,165.1 284.48,179.07 C31.2 | v298.45,149.86 C13.- | 358.14,193.04 E2.6 | v259.08,133.35 257.81,134.62 Q19.1
  ECO1 0.813: C31.2 283.21,195.58 E11.12
  Bottom 0.813: E26.1 52.07,203.2 52.07,185.42 | E17.7 R138.1 R137.1 | 52.07,185.42 C39.2 59.69,189.23 62.23,193.04 64.77,194.31 Q3.1 72.39,191.77 74.93,191.77 80.01,194.31 Q4.1 85.09,194.31 87.63,191.77 90.17,191.77 93.98,194.31 Q5.1 101.6,191.77 106.68,191.77 109.22,194.31 Q6.1 114.3,194.31 123.19,185.42 C38.2 | 52.07,185.42 50.8,185.42 40.64,194.31 Q2.1 34.29,194.31 30.48,191.77 27.94,191.77 Q1.1 | E19.7 R135.1 R134.1 R133.1 | v5.08,175.26 2.54,165.1 2.54,157.48 5.08,154.94 v22.86,154.94 | E18.1 198.12,203.2 199.39,185.42 | 199.39,185.42 196.85,185.42 Q10.1 181.61,194.31 177.8,191.77 175.26,191.77 172.72,194.31 Q9.1 arc-29 171.45,194.31 167.64,194.31 163.83,191.77 161.29,191.77 158.75,194.31 Q8.1 153.67,194.31 149.86,191.77 147.32,191.77 144.78,194.31 Q7.1 138.43,194.31 129.54,185.42 C38.2 | E20.7 149.86,111.76 149.86,114.3 | E22.1 125.73,203.2 125.73,190.5 128.27,187.96 C38.2 | 27.94,111.76 R139.1 R140.1 R141.1 E27.7 46.99,111.76 46.99,123.19 50.8,127 58.42,127 71.12,130.81 76.2,130.81 81.28,128.27 E24.1 86.36,124.46 88.9,121.92 88.9,116.84 | 27.94,111.76 E28.9 | 149.86,114.3 E20.5 | 149.86,114.3 E20.10 | 199.39,185.42 C37.2 201.93,185.42 210.82,194.31 Q11.1 217.17,194.31 218.44,193.04 223.52,193.04 224.79,194.31 Q12.1 232.41,194.31 233.68,193.04 236.22,193.04 237.49,194.31 237.49,203.2 C36.2 | 149.86,119.38 149.86,114.3 | 149.86,119.38 E20.12 | 27.94,111.76 27.94,115.57 26.67,116.84 E28.11 22.86,116.84 20.32,114.3 E28.5 | 149.86,119.38 149.86,121.92 E20.1 142.24,129.54 130.81,129.54 | 88.9,116.84 E24.11 | v34.29,133.35 30.48,129.54 24.13,129.54 E28.1 C16.-
  Bottom 0.813: U$2.DT1 107.95,8.26 v107.95,17.78 | 88.9,114.3 88.9,116.84 | 88.9,114.3 E24.5 | E24.7 86.36,109.22 88.9,111.76 | 88.9,111.76 88.9,114.3 | 130.81,129.54 v130.81,132.08 | R127.1 R128.1 E25.7 | 130.81,129.54 118.11,129.54 110.49,124.46 110.49,111.76 E23.7 R130.1 R129.1 E24.9 88.9,111.76 | E21.7 R132.1 R131.1 | D85.A 24.13,66.04 v34.29,66.04 47.62,66.04 | 47.62,66.04 D94.A | U$2.DF1 139.7,8.26 v139.7,19.05 v139.7,21.59 | 62.23,66.04 D95.A | 62.23,66.04 47.62,66.04 | E12.7 270.51,165.1 270.51,179.07 C33.2 | 76.2,66.04 D96.A | 76.2,66.04 62.23,66.04 | U$2.CT1 177.8,8.26 C41.+ v185.42,19.05 | U$2.DC1 149.86,8.26 v149.86,19.05 v149.86,21.59 149.86,26.67 | 91.44,66.04 D97.A | 91.44,66.04 76.2,66.04 | v251.46,187.96 247.65,191.77 247.65,205.74 | v210.82,135.89 218.44,132.08 220.98,132.08 222.25,130.81 222.25,129.54 226.06,125.73 226.06,121.92 E16.12 219.71,119.38 | 104.14,66.04 D98.A | 104.14,66.04 91.44,66.04 | 149.86,26.67 v146.05,26.67 | 149.86,26.67 v167.64,26.67 | U$2.CN1 190.5,8.26 v190.5,19.05 | 119.38,66.04 D99.A | 119.38,66.04 104.14,66.04 | 247.65,205.74 E15.1 | 247.65,205.74 250.19,208.28 254,208.28 C34.2 | 133.35,66.04 D100.A | 133.35,66.04 119.38,66.04 | U$2.CC1 219.71,8.26 v219.71,19.05 v209.55,19.05 209.55,8.26 U$2.CF1 | 147.32,66.04 D101.A | 147.32,66.04 133.35,66.04 | 161.29,66.04 D102.A | 161.29,66.04 147.32,66.04 | 171.45,66.04 D103.A | 171.45,66.04 161.29,66.04 | U$2.AN1 323.85,8.26 v323.85,20.32 C17.+ | E13.5 265.43,198.12 265.43,205.74 | 265.43,205.74 E13.1 | E16.5 E16.6 217.17,111.76 219.71,114.3 | E16.1 219.71,120.65 219.71,119.38 | U$2.AT1 311.15,8.26 C17.+ | U$2.BT1 241.3,8.26 v241.3,20.32 C40.+ | U$2.BN1 254,8.26 v254,20.32 C40.+